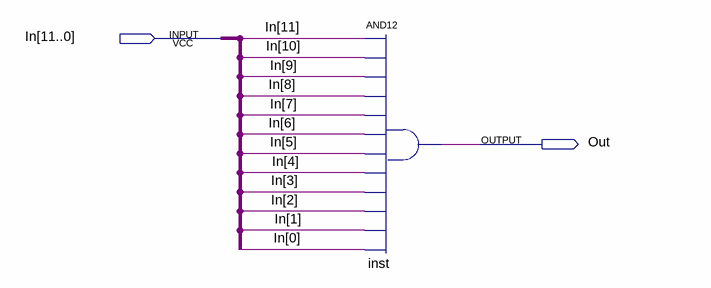
[diagram p0: schematic sheet]
// Quartus schematic and12_bus.bdf as structural Verilog: 1 symbols, 2 pins
module and12_bus (
  input  [11:0] In,
  output Out
);

  and inst (Out, In[11], In[10], In[9], In[8], In[7], In[6], In[5], In[4], In[3], In[2], In[1], In[0]);
endmodule
